# Altium schematic sheet Netscale48HD_Sensorbar.SchDoc: Sensorbar Slave Overall Schematic
size A3; CompanyName: Reichle & De-Massari; Organization: Reichle & De-Massari; Address1: Binzstrasse 32; Address2: 8620 Wetzikon; Address3: Switzerland; DocumentNumber: 1; Revision: V0.2; SheetNumber: 1; SheetTotal: 5
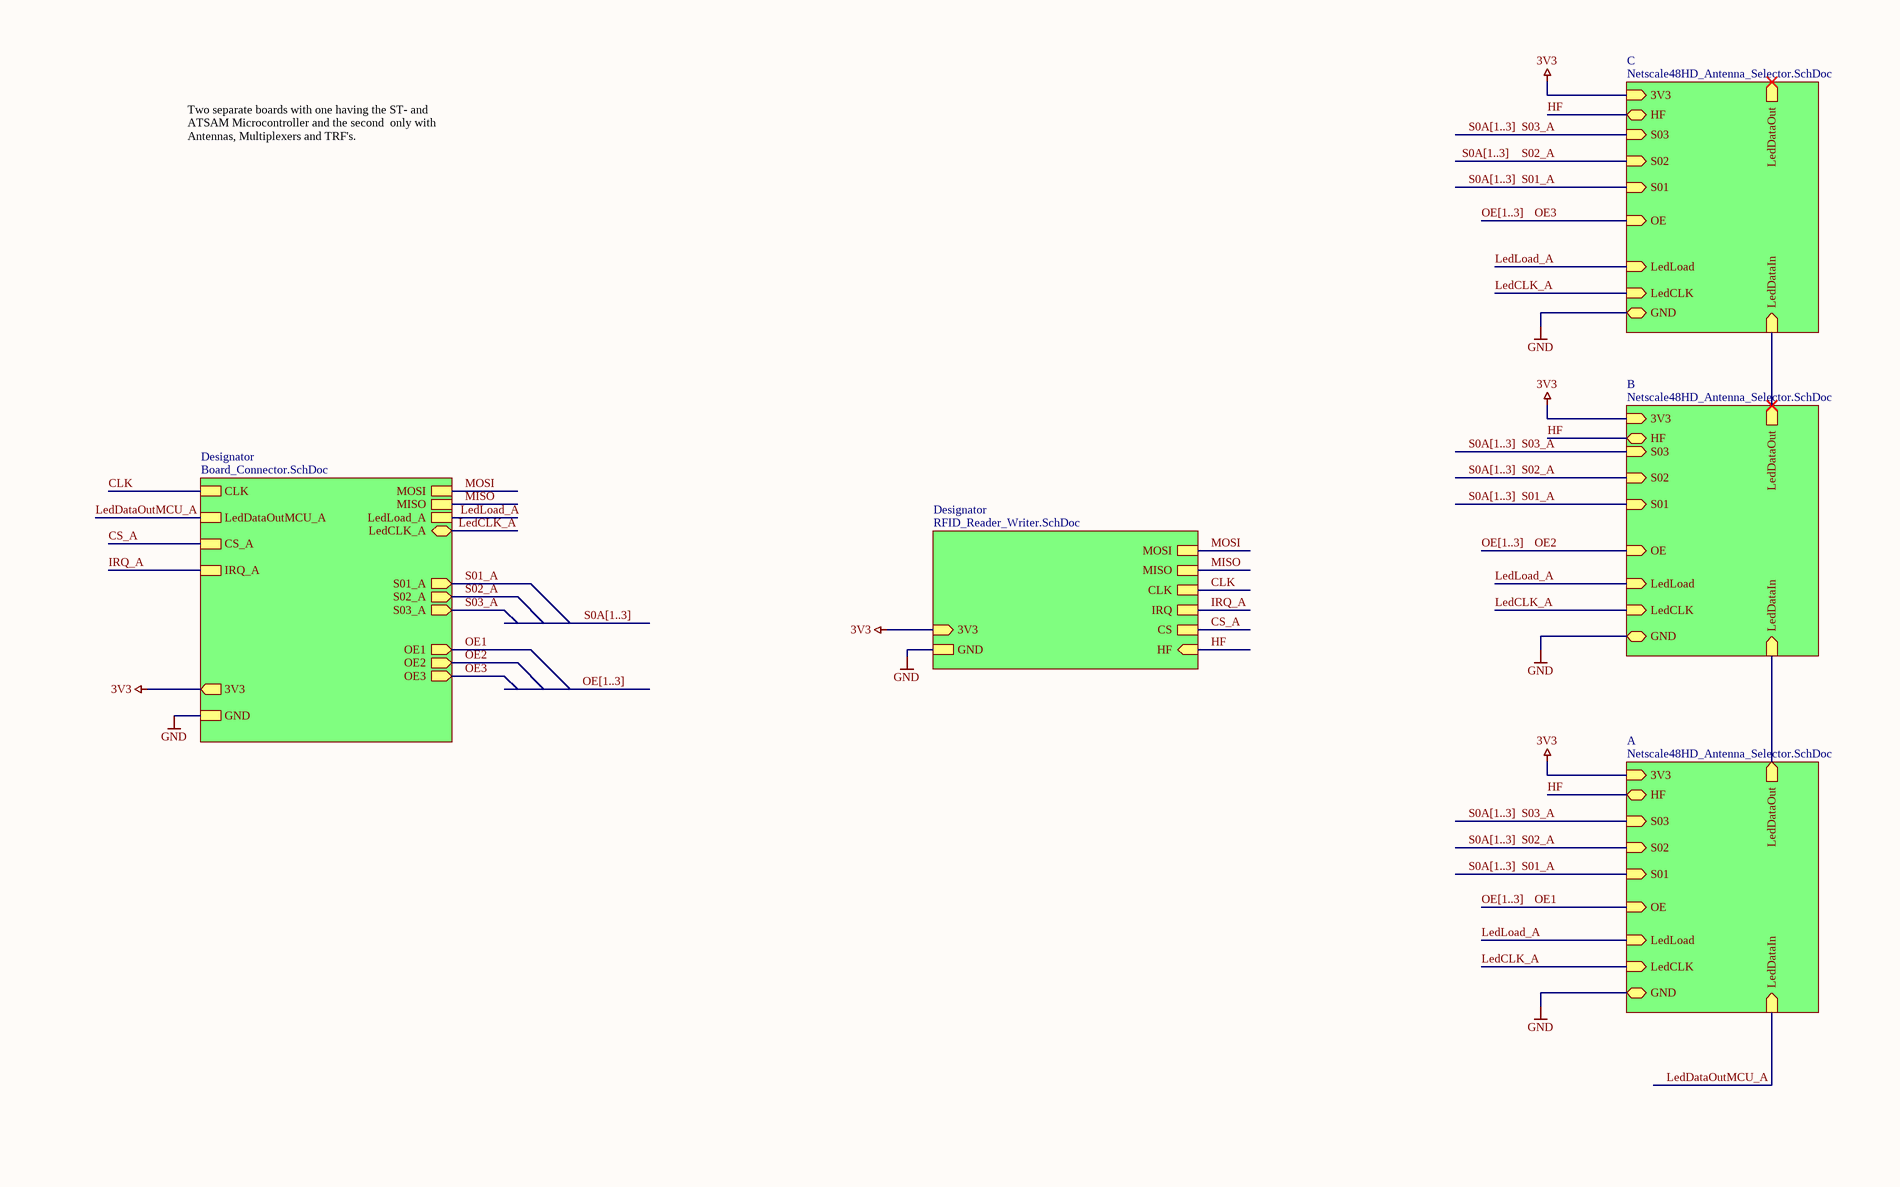
[diagram p0: Netscale48HD_Sensorbar.SchDoc, top]

## Sub-sheets
A = Netscale48HD_Antenna_Selector.SchDoc: 3V3 (in), S03 (in), S02 (in), S01 (in), HF (bidir), LedLoad (in), LedCLK (in), GND (bidir), LedDataOut (out), LedDataIn (in), OE (in)
B = Netscale48HD_Antenna_Selector.SchDoc: 3V3 (in), S03 (in), S02 (in), S01 (in), HF (bidir), LedLoad (in), LedCLK (in), GND (bidir), LedDataOut (out), LedDataIn (in), OE (in)
C = Netscale48HD_Antenna_Selector.SchDoc: 3V3 (in), S03 (in), S02 (in), S01 (in), HF (bidir), LedLoad (in), LedCLK (in), GND (bidir), LedDataOut (out), LedDataIn (in), OE (in)
Designator = RFID_Reader_Writer.SchDoc: MOSI, MISO, 3V3 (in), GND, CLK, IRQ, HF (in), CS
Designator = Board_Connector.SchDoc: CLK, 3V3 (out), GND, MOSI, MISO, S01_A (out), S02_A (out), S03_A (out), LedLoad_A, LedCLK_A (bidir), OE1 (out), OE2 (out), OE3 (out), LedDataOutMCU_A, CS_A, IRQ_A

## Nets
3V3: sheet A/3V3, sheet B/3V3, sheet C/3V3, sheet Designator/3V3, sheet Designator/3V3
GND: sheet A/GND, sheet B/GND, sheet C/GND, sheet Designator/GND, sheet Designator/GND
CLK: sheet Designator/CLK, sheet Designator/CLK
CS_A: sheet Designator/CS, sheet Designator/CS_A
HF: sheet A/HF, sheet B/HF, sheet C/HF, sheet Designator/HF
IRQ_A: sheet Designator/IRQ, sheet Designator/IRQ_A
LedCLK_A: sheet A/LedCLK, sheet B/LedCLK, sheet C/LedCLK, sheet Designator/LedCLK_A
LedDataOutMCU_A: sheet A/LedDataIn, sheet Designator/LedDataOutMCU_A
LedLoad_A: sheet A/LedLoad, sheet B/LedLoad, sheet C/LedLoad, sheet Designator/LedLoad_A
MISO: sheet Designator/MISO, sheet Designator/MISO
MOSI: sheet Designator/MOSI, sheet Designator/MOSI
OE1: sheet A/OE, sheet Designator/OE1
OE2: sheet B/OE, sheet Designator/OE2
OE3: sheet C/OE, sheet Designator/OE3
S01_A: sheet A/S01, sheet B/S01, sheet C/S01, sheet Designator/S01_A
S02_A: sheet A/S02, sheet B/S02, sheet C/S02, sheet Designator/S02_A
S03_A: sheet A/S03, sheet B/S03, sheet C/S03, sheet Designator/S03_A
(unnamed): sheet A/LedDataOut, sheet B/LedDataIn
(unnamed): sheet B/LedDataOut, sheet C/LedDataIn

## Buses and harness runs
bus OE[1..3]
bus S0A[1..3]

## Notes on the sheet
- 10,8
- 16,8
- 7
- 212,4
- Two separate boards with one having the ST- and ATSAM Microcontroller and the second  only with Antennas, Multiplexers and TRF's.
- Title
- Size:
- Date:
- A3
- Number:
- Time:
- Revision:
- Sheet
- of
- File: